# EAGLE design R_P (EAGLE 9.6.2)
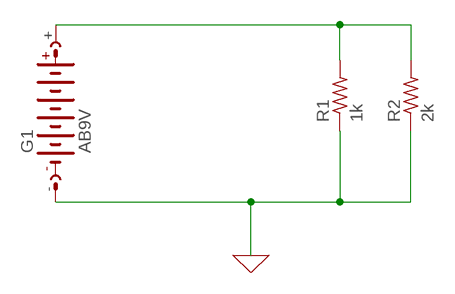
[diagram p0: schematic, sheet 1]

## Parts
G1  AB9V  [AB9V]
R1  1k  R-US_0204/2V  [0204V]
R2  2k  R-US_0204/2V  [0204V]

## Nets
0: G1.- R1.1 R2.1 ; supply symbol labelled GND
N$1: G1.+ R1.2 R2.2

## Library data of the parts
G1 = battery:AB9V: 9-V BATTERY CLIP
R1 R2 = adafruit:R-US_: RESISTOR, American symbol

## Board
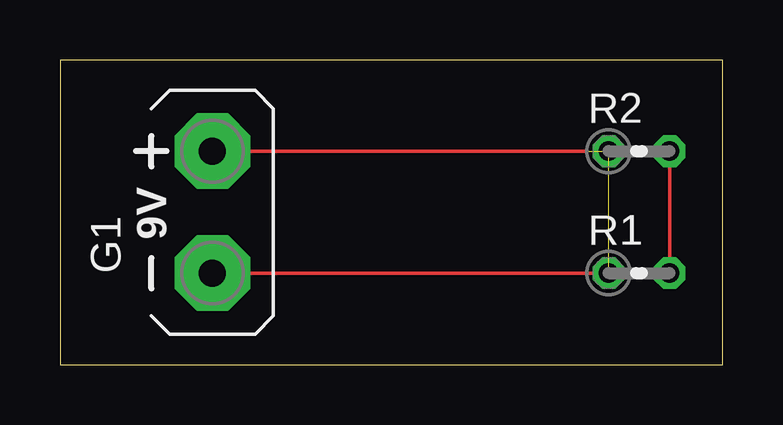
[diagram p1: board, top side]

Size 27.61 x 12.69 mm. Coordinates in mm from the lower left corner, seen from the top.
Outline: 0,0 27.61,0 27.61,12.69 0,12.69 0,0
Copper layers (1*16): Top 0.035mm / dielectric 1.5mm / Bottom 0.035mm
Design rules "default": minimum track width 6mil, minimum drill 0.35mm, track to track 6mil, track to pad 6mil, pad to pad 6mil, via to via 6mil, smd to smd 6mil, copper to edge 40mil, drill to drill 6mil, minimum pad ring 10mil, minimum via ring 8mil, stop-mask expansion 4mil, vias tented up to drill 0mil, thermal gap 10mil

### Footprints (pad centres in the part's own frame; a part is rotated, then mirrored left to right if it is on the bottom)
AB9V = drill 1.118 pad 3.15 octagon: + 0,2.54; - 0,-2.54
0204V = drill 0.813 octagon: 1 -1.27,0; 2 1.27,0

### Placement (x,y rotation side)
G1  6.35,6.35 0 top
R1  24.13,3.81 0 top
R2  24.13,8.89 0 top

### Tracks (layer width: path | path; a pad name or v marks a point on that pad's centre or on a via)
0  (1 unrouted)
  Top 0.152: R1.1 G1.-
N$1  (1 unrouted)
  Top 0.152: G1.+ 21.97,8.89 | R1.2 R2.2